# Altium schematic sheet 11.MIPI DSI_CSI.SchDoc
size 297 x 209 mm; SheetNumber: 11; SheetTotal: 13
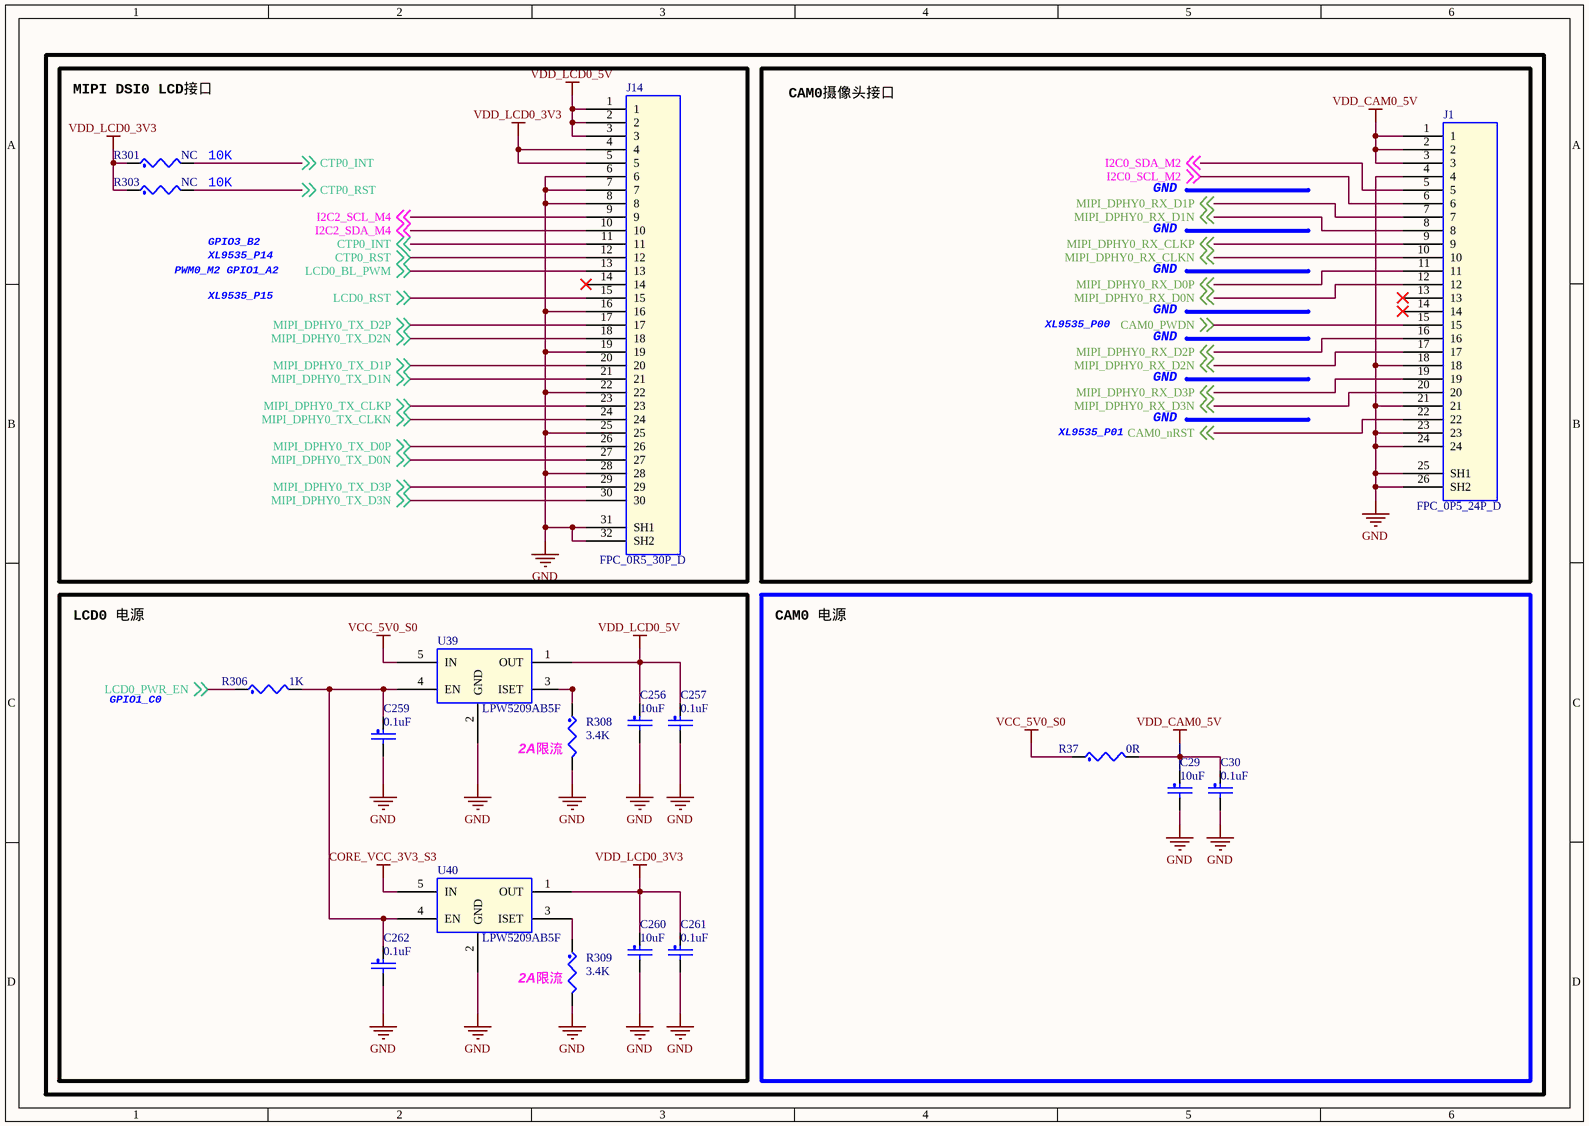
[diagram p0: 11.MIPI DSI_CSI.SchDoc]

## Parts
C29  10uF  [C0402]
C30  0.1uF  [C0402]
C256  10uF  [C0402]
C257  0.1uF  [C0402]
C259  0.1uF  [C0402]
C260  10uF  [C0402]
C261  0.1uF  [C0402]
C262  0.1uF  [C0402]
J1  FPC_0P5_24P_D  [fpc_24p_0p5]
J14  FPC_0R5_30P_D  [FPC-30P-0P5]
R37  0R  [R0402]
R301  NC  [R0402]
R303  NC  [R0402]
R306  1K  [R0402]
R308  3.4K  [R0402]
R309  3.4K  [R0402]
U39  LPW5209AB5F  [SOT23-5]
U40  LPW5209AB5F  [SOT23-5]

## Blocks framed on the sheet
MIPI DSI0 LCD接口: J14 R301 R303
CAM0摄像头接口: J1
LCD0 电源: C256 C257 C259-C262 R306 R308 R309 U39 U40
CAM0 电源: C29 C30 R37

## Nets
CORE_VCC_3V3_S3: U40.5(IN)
GND: C29.2 C30.2 C256.2 C257.2 C259.2 C260.2 C261.2 C262.2 J1.4 J1.18 J1.21 J1.23 J1.24 J1.25(SH1) J1.26(SH2) J14.6 J14.7 J14.8 J14.16 J14.19 J14.22 J14.25 J14.28 J14.31(SH1) J14.32(SH2) R308.2 R309.2 U39.2(GND) U40.2(GND)
VCC_5V0_S0: R37.1 U39.5(IN)
VDD_CAM0_5V: C29.1 C30.1 J1.1 J1.2 J1.3 R37.2
VDD_LCD0_3V3: C260.1 C261.1 J14.4 J14.5 R301.1 R303.1 U40.1(OUT)
VDD_LCD0_5V: C256.1 C257.1 J14.1 J14.2 J14.3 U39.1(OUT)
CAM0_nRST: J1.22 ; off-sheet CAM0_nRST
CAM0_PWDN: J1.15 ; off-sheet CAM0_PWDN
CTP0_INT: J14.11 R301.2 ; off-sheet CTP0_INT
CTP0_RST: J14.12 R303.2 ; off-sheet CTP0_RST
I2C0_SCL_M2: J1.6 ; off-sheet I2C0_SCL_M2
I2C0_SDA_M2: J1.5 ; off-sheet I2C0_SDA_M2
I2C2_SCL_M4: J14.9 ; off-sheet I2C2_SCL_M4
I2C2_SDA_M4: J14.10 ; off-sheet I2C2_SDA_M4
LCD0_BL_PWM: J14.13 ; off-sheet LCD0_BL_PWM
LCD0_PWR_EN: R306.1 ; off-sheet LCD0_PWR_EN
LCD0_RST: J14.15 ; off-sheet LCD0_RST
MIPI_DPHY0_RX_CLKN: J1.10 ; off-sheet MIPI_DPHY0_RX_CLKN
MIPI_DPHY0_RX_CLKP: J1.9 ; off-sheet MIPI_DPHY0_RX_CLKP
MIPI_DPHY0_RX_D0N: J1.12 ; off-sheet MIPI_DPHY0_RX_D0N
MIPI_DPHY0_RX_D0P: J1.11 ; off-sheet MIPI_DPHY0_RX_D0P
MIPI_DPHY0_RX_D1N: J1.8 ; off-sheet MIPI_DPHY0_RX_D1N
MIPI_DPHY0_RX_D1P: J1.7 ; off-sheet MIPI_DPHY0_RX_D1P
MIPI_DPHY0_RX_D2N: J1.17 ; off-sheet MIPI_DPHY0_RX_D2N
MIPI_DPHY0_RX_D2P: J1.16 ; off-sheet MIPI_DPHY0_RX_D2P
MIPI_DPHY0_RX_D3N: J1.20 ; off-sheet MIPI_DPHY0_RX_D3N
MIPI_DPHY0_RX_D3P: J1.19 ; off-sheet MIPI_DPHY0_RX_D3P
MIPI_DPHY0_TX_CLKN: J14.24 ; off-sheet MIPI_DPHY0_TX_CLKN
MIPI_DPHY0_TX_CLKP: J14.23 ; off-sheet MIPI_DPHY0_TX_CLKP
MIPI_DPHY0_TX_D0N: J14.27 ; off-sheet MIPI_DPHY0_TX_D0N
MIPI_DPHY0_TX_D0P: J14.26 ; off-sheet MIPI_DPHY0_TX_D0P
MIPI_DPHY0_TX_D1N: J14.21 ; off-sheet MIPI_DPHY0_TX_D1N
MIPI_DPHY0_TX_D1P: J14.20 ; off-sheet MIPI_DPHY0_TX_D1P
MIPI_DPHY0_TX_D2N: J14.18 ; off-sheet MIPI_DPHY0_TX_D2N
MIPI_DPHY0_TX_D2P: J14.17 ; off-sheet MIPI_DPHY0_TX_D2P
MIPI_DPHY0_TX_D3N: J14.30 ; off-sheet MIPI_DPHY0_TX_D3N
MIPI_DPHY0_TX_D3P: J14.29 ; off-sheet MIPI_DPHY0_TX_D3P
NetC259_1: C259.1 C262.1 R306.2 U39.4(EN) U40.4(EN)
NetR308_1: R308.1 U39.3(ISET)
NetR309_1: R309.1 U40.3(ISET)

Not connected (* = marked no-connect by the designer): J1 13* 14*; J14 14*

## Notes on the sheet
- 10K
- GND
- GPIO3_B2
- XL9535_P14
- PWM0_M2 GPIO1_A2
- XL9535_P15
- XL9535_P00
- XL9535_P01
- GPIO1_C0
- 2A限流

## Library data of the parts
C29 C30 C256 C257 C259-C262 = CAP_NP
J1 = FPC-24P
J14 = FPC-30P
R37 R301 R303 R306 R308 R309 = RES